# Altium schematic sheet motordriver-v4.0_hall-sensors.SchDoc
size A4; SheetNumber: 4; SheetTotal: 4
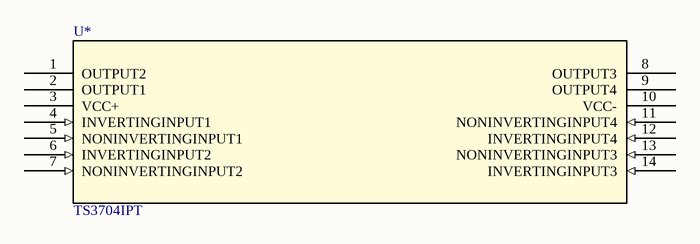
[diagram p0: motordriver-v4.0_hall-sensors.SchDoc]

## Parts
U*  TS3704IPT  [TS3704IPT]

## Nets

Not connected (* = marked no-connect by the designer): U* 1(OUTPUT2) 2(OUTPUT1) 3(VCC+) 4(INVERTINGINPUT1) 5(NONINVERTINGINPUT1) 6(INVERTINGINPUT2) 7(NONINVERTINGINPUT2) 8(OUTPUT3) 9(OUTPUT4) 10(VCC-) 11(NONINVERTINGINPUT4) 12(INVERTINGINPUT4) 13(NONINVERTINGINPUT3) 14(INVERTINGINPUT3)

## Library data of the parts
U* = TS3704IPT: IC COMP QUAD CMOS MCRPWR 14TSSOP; Manufacturer: STMicroelectronics; Manu PN: TS3704IPT; Digikey PN: 497-4064-1-ND; Digikey: https://www.digikey.ca/en/products/detail/stmicroelectronics/TS3704IPT/720955?s=N4IgTCBcDaICoGUDMB2ADAFgJIAU4gF0BfIA